# EAGLE schematic air_brake (EAGLE 9.5.1)
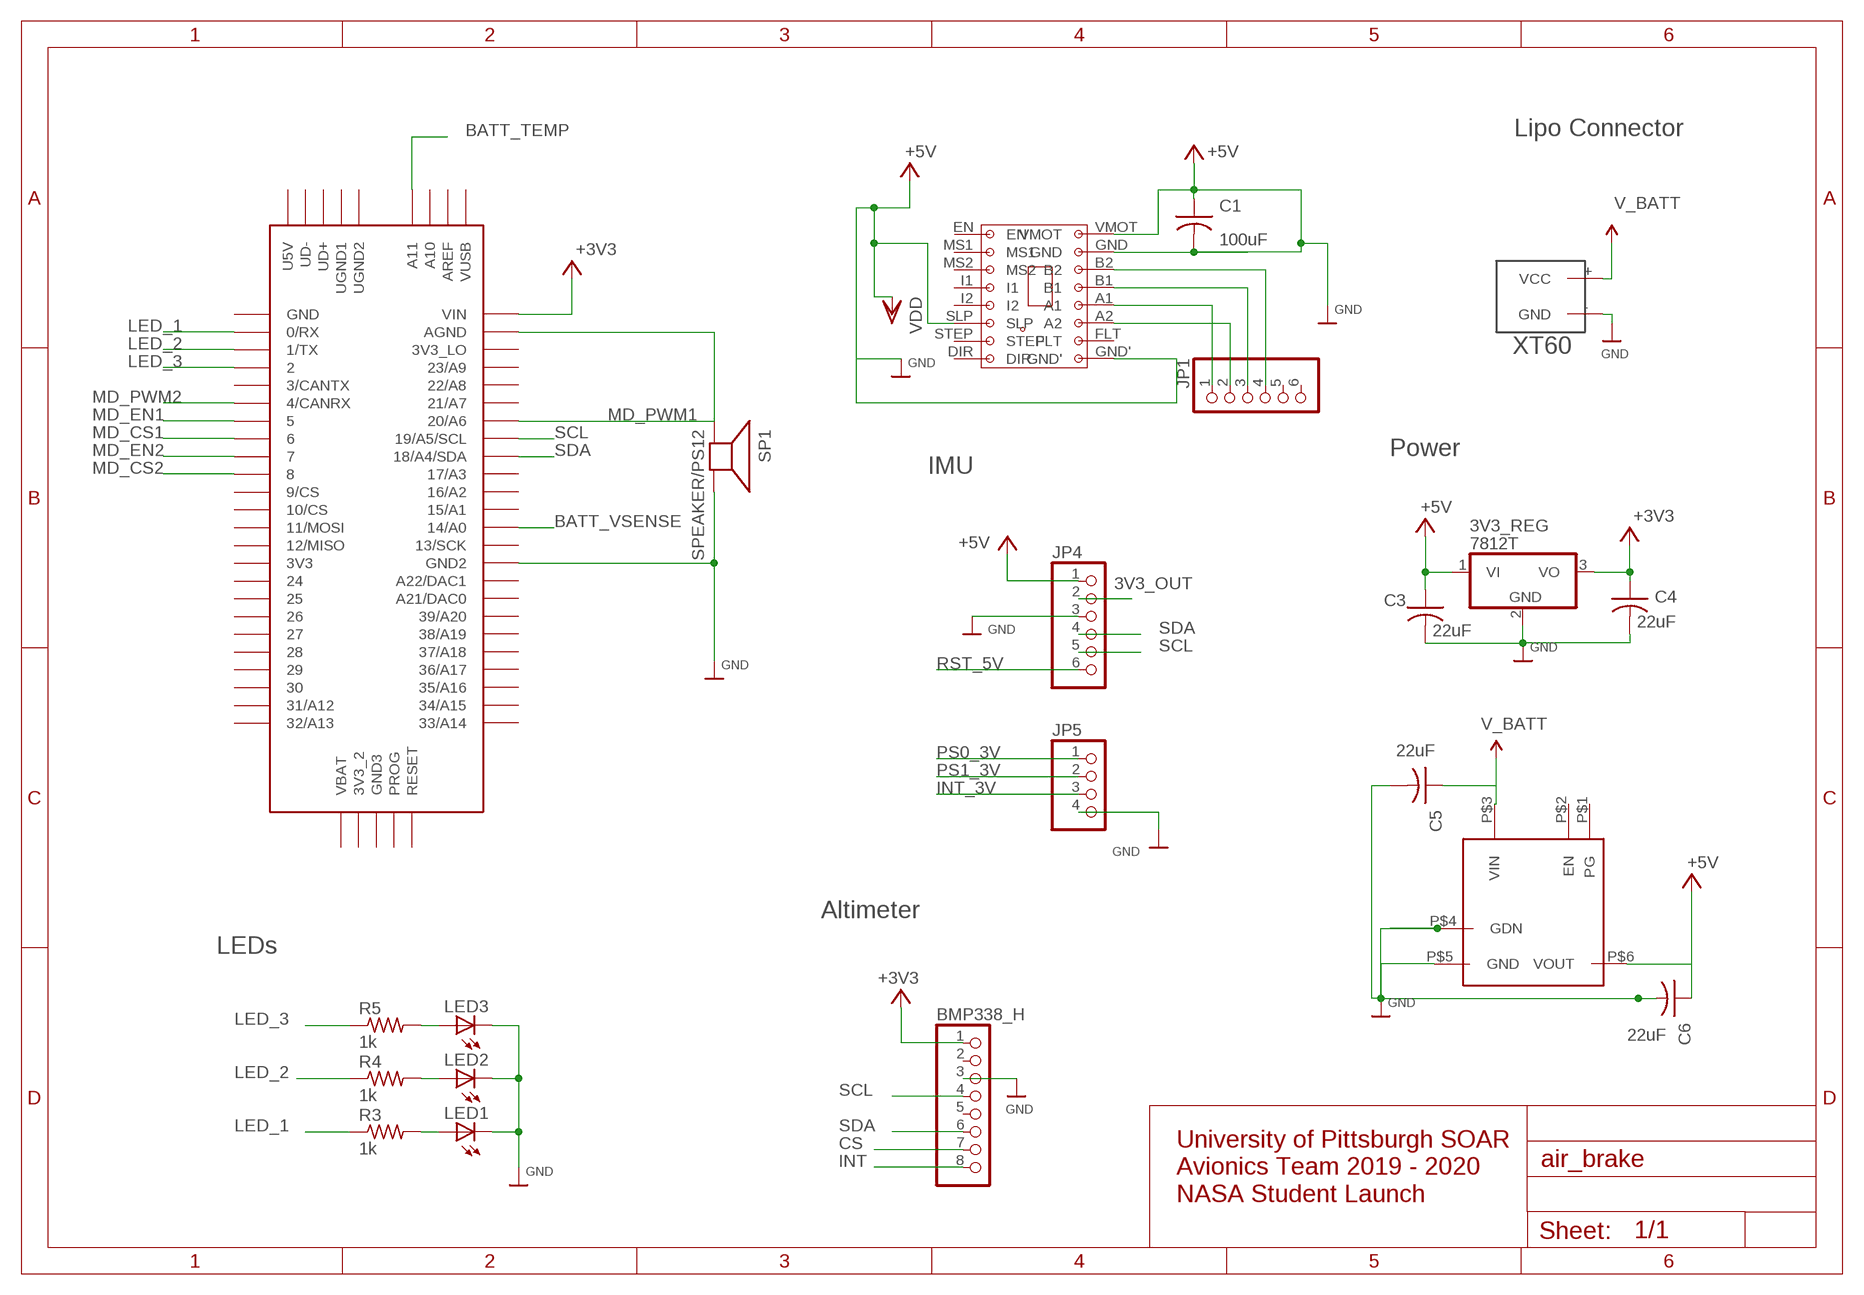
[diagram p0: schematic, sheet 1]

## Parts
3V3_REG  7812T  [TO220H]
BMP338_H  HEADER-1X870MIL  [1X08_ROUND_70]
C1  100uF  C-US025-040X050  [C025-040X050]
C3  22uF  C-US025-040X050  [C025-040X050]
C4  22uF  C-US025-040X050  [C025-040X050]
C5  22uF  C-US025-040X050  [C025-040X050]
C6  22uF  C-US025-040X050  [C025-040X050]
JP1  PINHD-1X6  [1X06]
JP4  HEADER-1X676MIL  [1X06_ROUND_76]
JP5  HEADER-1X476MIL  [1X04_ROUND_76]
LED1  LED3MM  [LED3MM]
LED2  LED3MM  [LED3MM]
LED3  LED3MM  [LED3MM]
R3  1k  R-US_0309/10  [0309/10]
R4  1k  R-US_0309/10  [0309/10]
R5  1k  R-US_0309/10  [0309/10]
SP1  SPEAKER/PS12  [PS12]
U$1  XT60  [XT60]
U$4  5VREGULATOR  [POLOLU5VREGULATOR]
U$8  MP6500STEPPERMOTORDRIVERCARRIER  [MP6500STEPPERMOTORDRIVERCARRIER]
U$14  TEENSY_3.5/3.6  [TEENSY_3.5/3.6]

## Nets
3V3_OUT: JP4.2
+3V3: 3V3_REG.3(VO) BMP338_H.1 C4.1 U$14.VIN
+5V: 3V3_REG.1(VI) C1.1 C1.2 C3.1 C6.1 JP4.1 U$4.P$6(VOUT) U$8.GND U$8.GND' U$8.SLP U$8.VMOT ; supply symbol labelled GND, VDD
BATT_TEMP: U$14.A11
BATT_VSENSE: U$14.14/A0
CS: BMP338_H.7
GND: 3V3_REG.2(GND) BMP338_H.3 C3.2 C4.2 C5.2 C6.2 JP4.3 JP5.4 LED1.K(C) LED2.K(C) LED3.K(C) SP1.P$2(-) U$1.-(GND) U$4.P$4(GDN) U$4.P$5(GND) U$14.GND2
INT: BMP338_H.8
INT_3V: JP5.3
LED_1: R3.1 U$14.0/RX
LED_2: R4.1 U$14.1/TX
LED_3: R5.1 U$14.2
MD_CS1: U$14.6
MD_CS2: U$14.8
MD_EN1: U$14.5
MD_EN2: U$14.7
MD_PWM1: SP1.P$1(+) U$14.20/A6 U$14.AGND
MD_PWM2: U$14.4/CANRX
N$1: JP1.1 U$8.A1
N$3: LED1.A R3.2
N$4: LED2.A R4.2
N$5: LED3.A R5.2
N$8: JP1.2 U$8.A2
N$9: JP1.3 U$8.B1
N$10: JP1.4 U$8.B2
PS0_3V: JP5.1
PS1_3V: JP5.2
RST_5V: JP4.6
SCL: BMP338_H.4 JP4.5 U$14.19/A5/SCL
SDA: BMP338_H.6 JP4.4 U$14.18/A4/SDA
V_BATT: C5.1 U$1.+(VCC) U$4.P$3(VIN)
Unconnected: BMP338_H.2 BMP338_H.5 JP1.5 JP1.6 U$4.P$1(PG) U$4.P$2(EN) U$8.DIR U$8.EN U$8.FLT U$8.I1 U$8.I2 U$8.MS1 U$8.MS2 U$8.STEP U$14.3/CANTX U$14.3V3 U$14.3V3_2 U$14.3V3_LO U$14.9/CS U$14.10/CS U$14.11/MOSI U$14.12/MISO U$14.13/SCK U$14.15/A1 U$14.16/A2 U$14.17/A3 U$14.21/A7 U$14.21/DAC0(A21/DAC0) U$14.22/A8 U$14.23/A9 U$14.24 U$14.25 U$14.26 U$14.27 U$14.28 U$14.29 U$14.30 U$14.31/A12 U$14.32/A13 U$14.33/A14 U$14.34/A15 U$14.35/A16 U$14.36/A17 U$14.37/A18 U$14.38/A19 U$14.39/A20 U$14.A10 U$14.A22/DAC1 U$14.AREF U$14.GND U$14.GND3 U$14.PROG U$14.RESET U$14.U5V U$14.UD+ U$14.UD- U$14.UGND1 U$14.UGND2 U$14.VBAT U$14.VUSB

## Notes on the sheet
- Lipo Connector
- Power
- IMU
- Altimeter
- LEDs
- University of Pittsburgh SOAR
  Avionics Team 2019 - 2020
  NASA Student Launch

## Library data of the parts
3V3_REG = adafruit:78*: Positive VOLTAGE REGULATOR Added bigger pads to the TO-92 package
BMP338_H = microbuilder:HEADER-1X8: PIN HEADER
C1 C3-C6 = adafruit:C-US: CAPACITOR, American symbol
JP1 = pinhead:PINHD-1X6: PIN HEADER
JP4 = microbuilder:HEADER-1X6: PIN HEADER
JP5 = microbuilder:HEADER-1X4: PIN HEADER
LED1-LED3 = adafruit:LED: LED OSRAM: - CHIPLED LG R971, LG N971, LY N971, LG Q971, LY Q971, LO R971, LY R971 LH N974, LH R974 LS Q976, LO Q976, LY Q976 LO Q996 - Hyper CHIPLED LW Q18S LB Q993, LB Q99A, LB R99A - SideLED LS A670, LO A670, LY A670, LG A670, LP A670 LB A673, LV A673, LT A673, LW A673 LH A674 LY A675 LS A676, LA A676, LO A676, LY A676, LW A676 LS A679, LY A679, LG A679 - Hyper Micro SIDELED® LS Y876, LA Y876, LO Y876, LY Y876 LT Y87S - SmartLED LW L88C, LW L88S LB L89C, LB L89S, LG L890 LS L89K, LO L89K, LY L89K LS L896, LA L896, LO L896, LY L896 - TOPLED LS T670, LO T670, LY T670, LG T670, LP T670 LSG T670, LSP T670, LSY T670, LOP T670, LYG T670 LG T671, LOG T671, LSG T671 LB T673, LV T673, LT T673, LW T673 LH T674 LS T676, LA T676, LO T676, LY T676, LB T676, LH T676, LSB T676, LW T676 LB T67C, LV T67C, LT T67C, LS T67K, LO T67K, LY T67K, LW E67C LS E67B, LA E67B, LO E67B, LY E67B, LB E67C, LV E67C, LT E67C LW T67C LS T679, LY T679, LG T679 LS T770, LO T770, LY T770, LG T770, LP T770 LB T773, LV T773, LT T773, LW T773 LH T774 LS E675, LA E675, LY E675, LS T675 LS T776, LA T776, LO T776, LY T776, LB T776 LHGB T686 LT T68C, LB T68C - Hyper Mini TOPLED® LB M676 - Mini TOPLED Santana® LG M470 LS M47K, LO M47K, LY M47K Source: http://www.osram.convergy.de/
R3-R5 = resistor:R-US_: RESISTOR, American symbol
SP1 = adafruit:SPEAKER: SPEAKER Source: Buerklin Added PS12 (for part # PS1240 piezo) http://www.ladyada.net/library/pcb/eaglelibrary.html
U$1 = XT60:XT60: XT60
U$4 = Pololu 5V Regulator:5VREGULATOR
U$8 = MP6500 Stepper Motor Driver Carrier:MP6500STEPPERMOTORDRIVERCARRIER
U$14 = Teensy356:TEENSY_3.5/3.6